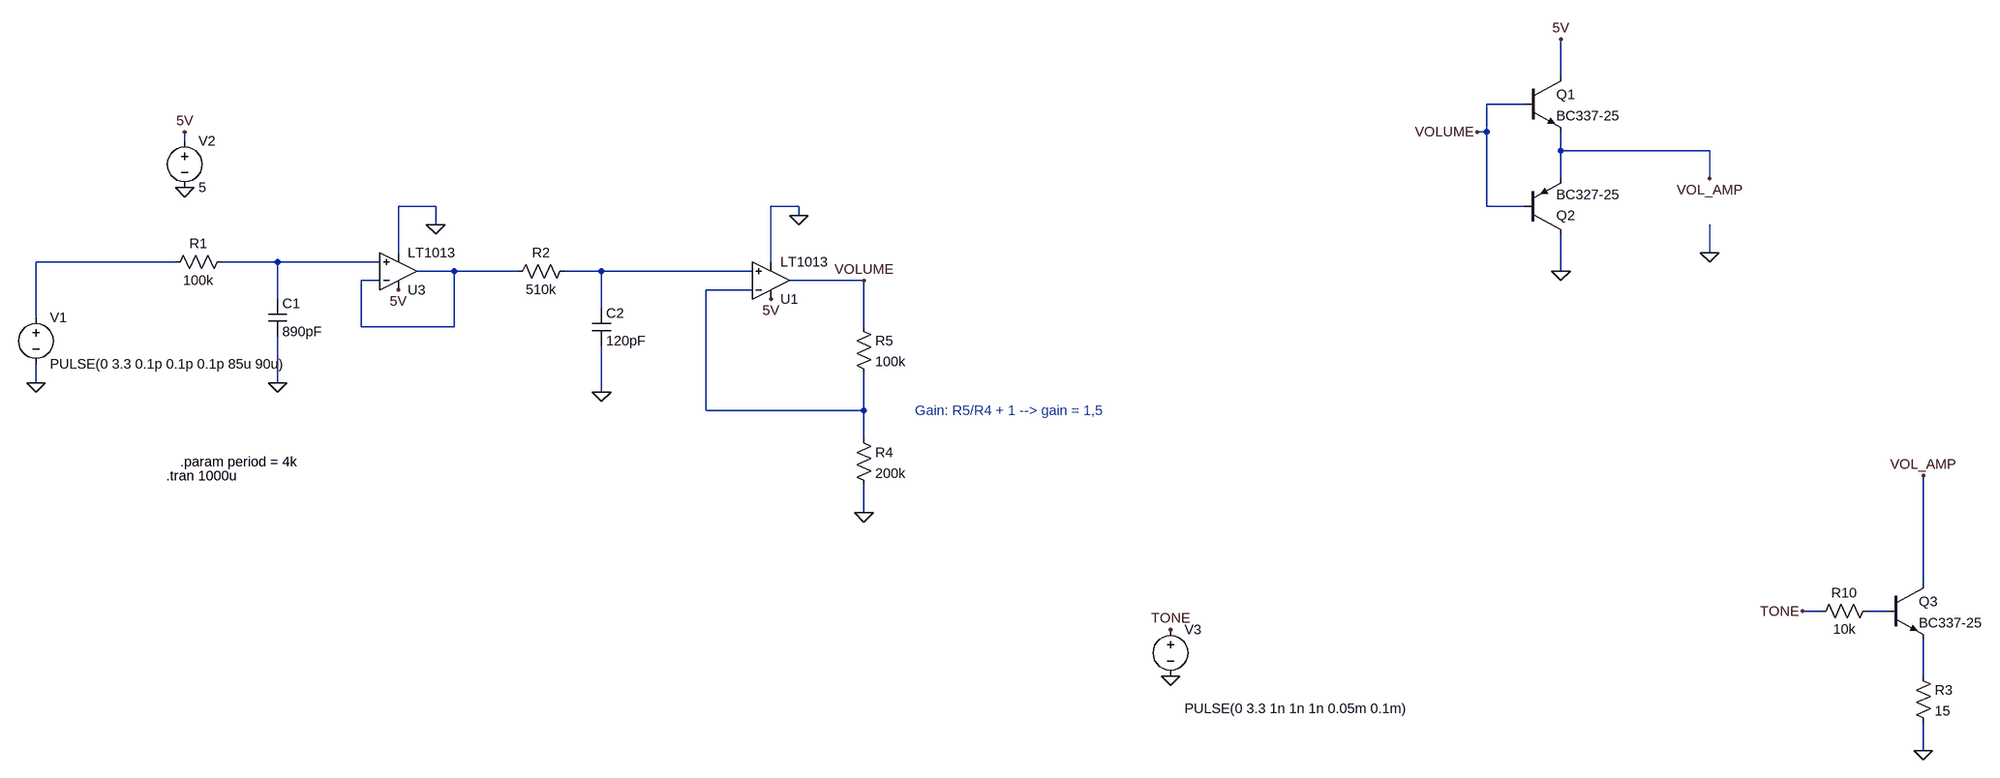
[diagram p0: schematic smoothing_SD_DAC_V4.asc]
smoothing_SD_DAC_V4.asc, the LTspice schematic file:
Version 4
SHEET 1 3364 948
WIRE 2384 -240 2384 -304
WIRE 2320 -192 2256 -192
WIRE 2256 -144 2256 -192
WIRE 2256 -144 2240 -144
WIRE -32 -128 -32 -144
WIRE 2384 -112 2384 -144
WIRE 2640 -112 2384 -112
WIRE 2384 -64 2384 -112
WIRE 2640 -64 2640 -112
WIRE 400 -16 336 -16
WIRE 1072 -16 1024 -16
WIRE 2256 -16 2256 -144
WIRE 2320 -16 2256 -16
WIRE 1072 0 1072 -16
WIRE 400 16 400 -16
WIRE 336 64 336 -16
WIRE 2640 64 2640 16
WIRE -48 80 -288 80
WIRE 128 80 32 80
WIRE 304 80 128 80
WIRE 1024 80 1024 -16
WIRE 432 96 368 96
WIRE 560 96 432 96
WIRE 704 96 640 96
WIRE 992 96 704 96
WIRE 2384 96 2384 32
WIRE 304 112 272 112
WIRE 1184 112 1056 112
WIRE 992 128 912 128
WIRE 128 144 128 80
WIRE 704 160 704 96
WIRE -288 176 -288 80
WIRE 272 192 272 112
WIRE 432 192 432 96
WIRE 432 192 272 192
WIRE 1184 192 1184 112
WIRE -288 288 -288 256
WIRE 128 288 128 208
WIRE 704 304 704 224
WIRE 912 336 912 128
WIRE 1184 336 1184 272
WIRE 1184 336 912 336
WIRE 1184 384 1184 336
WIRE 1184 512 1184 464
WIRE 3008 640 3008 448
WIRE 2832 688 2800 688
WIRE 2944 688 2912 688
WIRE 3008 800 3008 736
WIRE 3008 928 3008 880
FLAG 128 288 0
FLAG 704 304 0
FLAG -288 288 0
FLAG 2640 64 0
FLAG 2384 -304 5V
FLAG 2384 96 0
FLAG 1072 0 0
FLAG -32 -48 0
FLAG -32 -144 5V
FLAG 1024 144 5V
FLAG 1184 512 0
FLAG 336 128 5V
FLAG 400 16 0
FLAG 3008 928 0
FLAG 1184 112 VOLUME
FLAG 2240 -144 VOLUME
FLAG 1712 800 0
FLAG 1712 720 TONE
FLAG 2800 688 TONE
FLAG 2640 -64 VOL_AMP
FLAG 3008 448 VOL_AMP
SYMBOL voltage -288 160 R0
WINDOW 123 0 0 Left 0
WINDOW 39 0 0 Left 0
SYMATTR InstName V1
SYMATTR Value PULSE(0 3.3 0.1p 0.1p 0.1p 85u 90u)
SYMBOL res 48 64 R90
WINDOW 0 0 56 VBottom 2
WINDOW 3 32 56 VTop 2
SYMATTR InstName R1
SYMATTR Value 100k
SYMBOL cap 112 144 R0
SYMATTR InstName C1
SYMATTR Value 890pF
SYMBOL res 656 80 R90
WINDOW 0 0 56 VBottom 2
WINDOW 3 32 56 VTop 2
SYMATTR InstName R2
SYMATTR Value 510k
SYMBOL cap 688 160 R0
SYMATTR InstName C2
SYMATTR Value 120pF
SYMBOL OpAmps\\LT1013 1024 176 M180
SYMATTR InstName U1
SYMBOL npn 2320 -240 R0
SYMATTR InstName Q1
SYMATTR Value BC337-25
SYMBOL pnp 2320 32 M180
SYMATTR InstName Q2
SYMATTR Value BC327-25
SYMBOL voltage -32 -144 R0
WINDOW 123 0 0 Left 0
WINDOW 39 24 44 Left 2
SYMATTR InstName V2
SYMATTR Value 5
SYMBOL res 1168 368 R0
SYMATTR InstName R4
SYMATTR Value 200k
SYMBOL res 1168 176 R0
SYMATTR InstName R5
SYMATTR Value 100k
SYMBOL OpAmps\\LT1013 336 160 M180
SYMATTR InstName U3
SYMBOL npn 2944 640 R0
SYMATTR InstName Q3
SYMATTR Value BC337-25
SYMBOL res 2928 672 R90
WINDOW 0 0 56 VBottom 2
WINDOW 3 32 56 VTop 2
SYMATTR InstName R10
SYMATTR Value 10k
SYMBOL voltage 1712 704 R0
WINDOW 3 24 152 Left 2
WINDOW 123 0 0 Left 0
WINDOW 39 24 124 Left 2
SYMATTR InstName V3
SYMATTR Value PULSE(0 3.3 1n 1n 1n 0.05m 0.1m)
SYMBOL res 2992 784 R0
SYMATTR InstName R3
SYMATTR Value 15
TEXT -40 424 Left 2 !.param period = 4k
TEXT -64 448 Left 2 !.tran 1000u
TEXT 1272 336 Left 2 ;Gain: R5/R4 + 1 --> gain = 1,5

The netlist it stands for:
* smoothing_SD_DAC_V4.asc
V1 N001 0 PULSE(0 3.3 0.1p 0.1p 0.1p 85u 90u)
R1 N002 N001 100k
C1 N002 0 890pF
R2 N004 N003 510k
C2 N004 0 120pF
XU1 N004 N005 5V 0 VOLUME LT1013  ; pins In+ In- V+ V- OUT
Q1 5V VOLUME VOL_AMP 0 BC337-25
Q2 0 VOLUME VOL_AMP 0 BC327-25
V2 5V 0 5
R4 N005 0 200k
R5 VOLUME N005 100k
XU3 N002 N003 5V 0 N003 LT1013  ; pins In+ In- V+ V- OUT
Q3 VOL_AMP N006 N007 0 BC337-25
R10 N006 TONE 10k
V3 TONE 0 PULSE(0 3.3 1n 1n 1n 0.05m 0.1m)
R3 N007 0 15
.model NPN NPN
.model PNP PNP
.lib standard.bjt
.param period = 4k
.tran 1000u
* Gain: R5/R4 + 1 --> gain = 1,5
.lib LTC.lib
.backanno
.end